# Altium project MOD-ADC-10.PrjPCB (part 1 of 2)
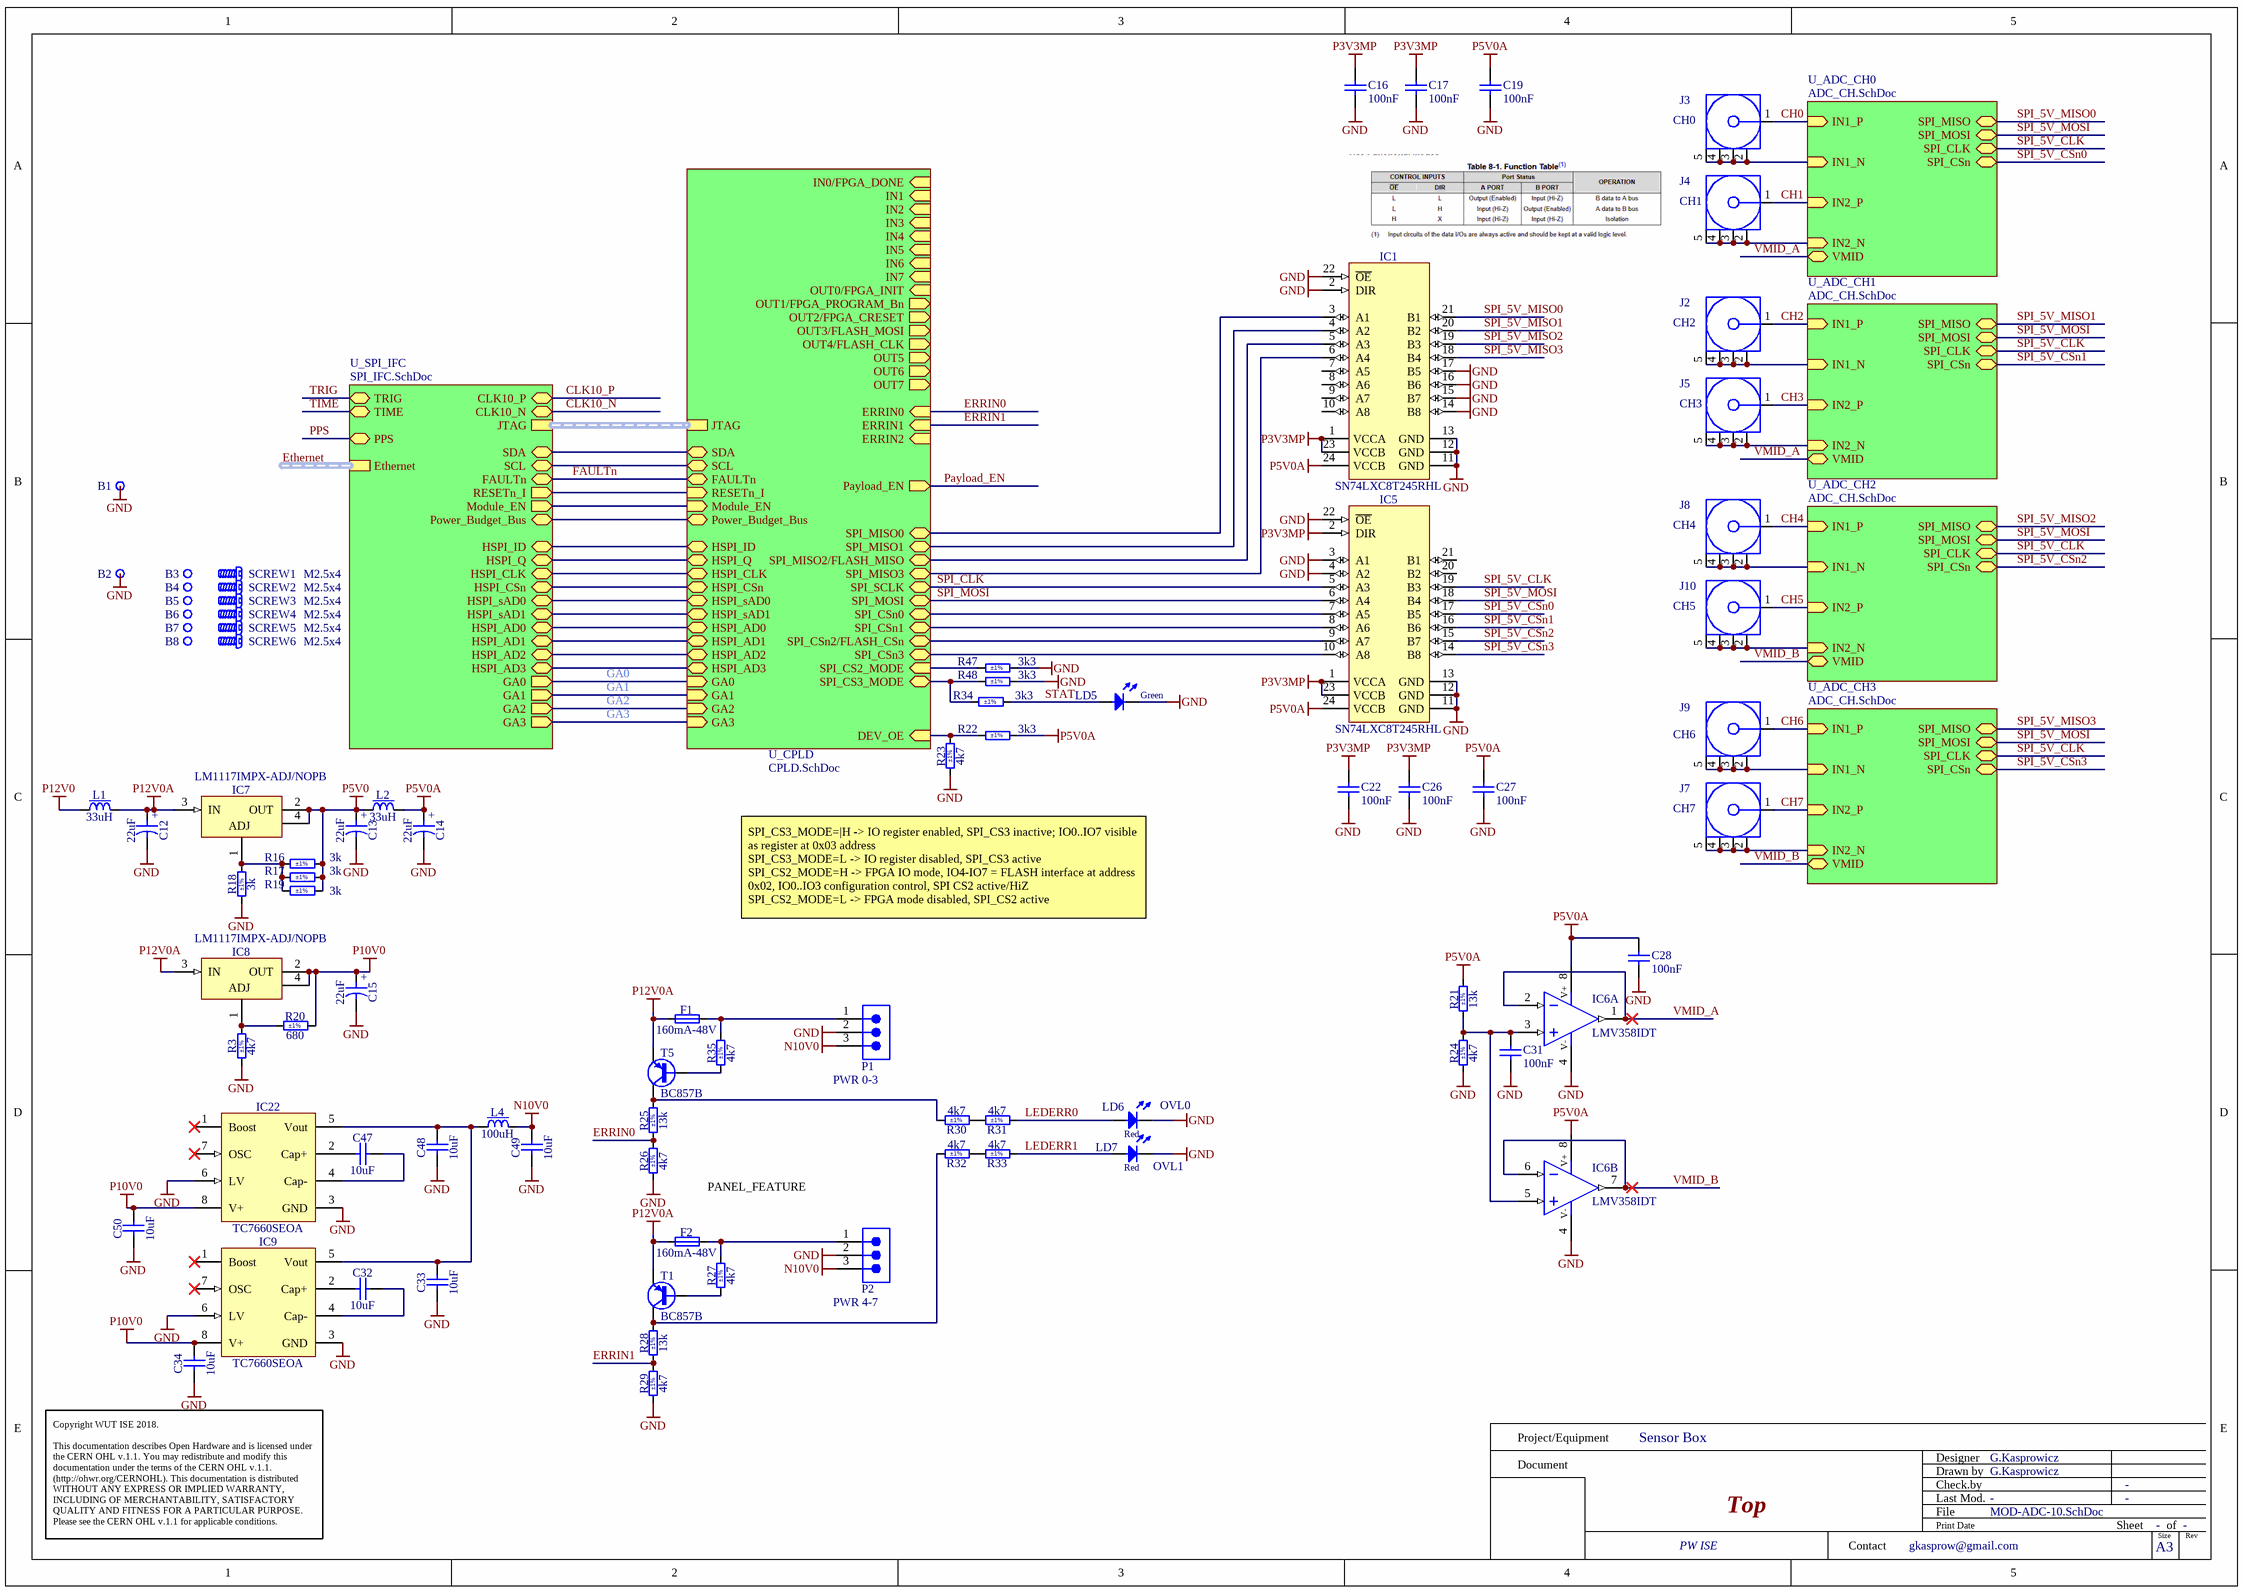
[diagram p0: MOD-ADC-10.SchDoc]
4 sheets, 199 parts. Net scope: hierarchical (ports join the sheet entries above them; power ports are global).
Board file: MOD-ADC-10.PCBDOC
Sheets:
  MOD-ADC-10.SchDoc
    U_SPI_IFC = SPI_IFC.SchDoc
    U_CPLD = CPLD.SchDoc
    U_ADC_CH0 = ADC_CH.SchDoc
    U_ADC_CH1 = ADC_CH.SchDoc
    U_ADC_CH2 = ADC_CH.SchDoc
    U_ADC_CH3 = ADC_CH.SchDoc

## Sheet MOD-ADC-10.SchDoc: =Project
size 420 x 297 mm; Author: G.Kasprowicz; CompanyName: WUT ISE; DrawnBy: G.Kasprowicz; Organization: WUT ISE; Address1: PW ISE; Address2: Nowowiejska 15/19 00-665 Warsaw; Address3: gkasprow@gmail.com; SheetNumber: -; SheetTotal: -; ModifiedBy: -; CheckedDate: -; Title2: Top; DivGrp: WUT ISE; Designer: G.Kasprowicz; SPICEModelCacheRYPVXPCY: <root> / <DocumentId>RYPVXPCY</DocumentId> / </root>; ModifiedDate: -; ProjectName: Sensor Box

### Parts
B1  Plated Hole  [MTG270_500]  (value not drawn)  (no BOM)
B2  Plated Hole  [MTG270_500]  (value not drawn)  (no BOM)
B3  Plated Hole  [MTG270_500]  (value not drawn)  (no BOM)
B4  Plated Hole  [MTG270_500]  (value not drawn)  (no BOM)
B5  Plated Hole  [MTG270_500]  (value not drawn)  (no BOM)
B6  Plated Hole  [MTG270_500]  (value not drawn)  (no BOM)
B7  Plated Hole  [MTG270_500]  (value not drawn)  (no BOM)
B8  Plated Hole  [MTG270_500]  (value not drawn)  (no BOM)
C12  22uF  [CAPMP3528X210N]
C13  22uF  [CAPMP3528X210N]
C14  22uF  [CAPMP3528X210N]
C15  22uF  [CAPMP3528X210N]
C16  100nF  [CAPC1005X55N]
C17  100nF  [CAPC1005X55N]
C19  100nF  [CAPC1005X55N]
C22  100nF  [CAPC1005X55N]
C26  100nF  [CAPC1005X55N]
C27  100nF  [CAPC1005X55N]
C28  100nF  [CAPC1005X55N]
C31  100nF  [CAPC1005X55N]
C32  10uF  [CAPC1608X80N]
C33  10uF  [CAPC1608X80N]
C34  10uF  [CAPC1608X80N]
C47  10uF  [CAPC1608X80N]
C48  10uF  [CAPC1608X80N]
C49  10uF  [CAPC1608X80N]
C50  10uF  [CAPC1608X80N]
F1  160mA-48V  [FUSRC3216X100N]
F2  160mA-48V  [FUSRC3216X100N]
IC1  SN74LXC8T245RHL  [TEXAS_RHL (S-PVQFN-N24)]
IC5  SN74LXC8T245RHL  [TEXAS_RHL (S-PVQFN-N24)]
IC6  LMV358IDT  [SOIC127P600X175-8N]  (parts A,B of 2)
IC7  LM1117IMPX-ADJ/NOPB  [SOT230P700X180-4N]
IC8  LM1117IMPX-ADJ/NOPB  [SOT230P700X180-4N]
IC9  TC7660SEOA  [SOIC127P600X175-8N]
IC22  TC7660SEOA  [SOIC127P600X175-8N]
J2  PANEL_LABEL: CH2  [60611002111502]  (hidden comment: 60611002111502)
J3  PANEL_LABEL: CH0  [60611002111502]  (hidden comment: 60611002111502)
J4  PANEL_LABEL: CH1  [60611002111502]  (hidden comment: 60611002111502)
J5  PANEL_LABEL: CH3  [60611002111502]  (hidden comment: 60611002111502)
J7  PANEL_LABEL: CH7  [60611002111502]  (hidden comment: 60611002111502)
J8  PANEL_LABEL: CH4  [60611002111502]  (hidden comment: 60611002111502)
J9  PANEL_LABEL: CH6  [60611002111502]  (hidden comment: 60611002111502)
J10  PANEL_LABEL: CH5  [60611002111502]  (hidden comment: 60611002111502)
L1  33uH  [IND_WURTH_WE-TPC_4828]
L2  33uH  [IND_WURTH_WE-TPC_4828]
L4  100uH  [INDM3225X240N]
LD5  Green  [LED_AVAGO_HSME-C120]
LD6  Red  PANEL_LABEL: OVL0  [LED_AVAGO_HSMC-C120]
LD7  Red  PANEL_LABEL: OVL1  [LED_AVAGO_HSMC-C120]
P1  PANEL_LABEL: PWR 0-3  [691382010003]  (hidden comment: 691382010003)
P2  PANEL_LABEL: PWR 4-7  [691382010003]  (hidden comment: 691382010003)
R3  4k7  Tolerance: ±1%  [RESC1608X55N]
R16  3k  Tolerance: ±1%  [RESC1608X55N]
R17  3k  Tolerance: ±1%  [RESC1608X55N]
R18  3k  Tolerance: ±1%  [RESC1608X55N]
R19  3k  Tolerance: ±1%  [RESC1608X55N]
R20  680  Tolerance: ±1%  [RESC1608X55N]
R21  13k  Tolerance: ±1%  [RESC1005X40N]
R22  3k3  Tolerance: ±1%  [RESC1005X40N]
R23  4k7  Tolerance: ±1%  [RESC1608X55N]
R24  4k7  Tolerance: ±1%  [RESC1608X55N]
R25  13k  Tolerance: ±1%  [RESC1005X40N]
R26  4k7  Tolerance: ±1%  [RESC1608X55N]
R27  4k7  Tolerance: ±1%  [RESC1608X55N]
R28  13k  Tolerance: ±1%  [RESC1005X40N]
R29  4k7  Tolerance: ±1%  [RESC1608X55N]
R30  4k7  Tolerance: ±1%  [RESC1608X55N]
R31  4k7  Tolerance: ±1%  [RESC1608X55N]
R32  4k7  Tolerance: ±1%  [RESC1608X55N]
R33  4k7  Tolerance: ±1%  [RESC1608X55N]
R34  3k3  Tolerance: ±1%  [RESC1005X40N]
R35  4k7  Tolerance: ±1%  [RESC1608X55N]
R47  3k3  Tolerance: ±1%  [RESC1005X40N]
R48  3k3  Tolerance: ±1%  [RESC1005X40N]
SCREW1  M2.5x4  [BOSSARD_BN5687-3061587_v]
SCREW2  M2.5x4  [BOSSARD_BN5687-3061587_v]
SCREW3  M2.5x4  [BOSSARD_BN5687-3061587_v]
SCREW4  M2.5x4  [BOSSARD_BN5687-3061587_v]
SCREW5  M2.5x4  [BOSSARD_BN5687-3061587_v]
SCREW6  M2.5x4  [BOSSARD_BN5687-3061587_v]
T1  BC857B  [SOT95P230X110-3N]
T5  BC857B  [SOT95P230X110-3N]

### Sub-sheets
U_ADC_CH0 = ADC_CH.SchDoc: SPI_MISO (bidir), SPI_MOSI (bidir), SPI_CLK (bidir), SPI_CSn (bidir), IN2_P (in), IN2_N (in), IN1_P (in), IN1_N (in), VMID (bidir)
U_ADC_CH1 = ADC_CH.SchDoc: SPI_MISO (bidir), SPI_MOSI (bidir), SPI_CLK (bidir), SPI_CSn (bidir), IN2_P (in), IN2_N (in), IN1_P (in), IN1_N (in), VMID (bidir)
U_ADC_CH2 = ADC_CH.SchDoc: SPI_MISO (bidir), SPI_MOSI (bidir), SPI_CLK (bidir), SPI_CSn (bidir), IN2_P (in), IN2_N (in), IN1_P (in), IN1_N (in), VMID (bidir)
U_ADC_CH3 = ADC_CH.SchDoc: SPI_MISO (bidir), SPI_MOSI (bidir), SPI_CLK (bidir), SPI_CSn (bidir), IN2_P (in), IN2_N (in), IN1_P (in), IN1_N (in), VMID (bidir)
U_CPLD = CPLD.SchDoc: SDA (bidir), SCL (bidir), RESETn_I (in), HSPI_ID (bidir), HSPI_Q (bidir), HSPI_CLK (bidir), HSPI_CSn (bidir), HSPI_sAD0 (bidir), HSPI_sAD1 (bidir), HSPI_AD0 (bidir), HSPI_AD1 (bidir), HSPI_AD2 (bidir), HSPI_AD3 (bidir), SPI_MISO2/FLASH_MISO (bidir), SPI_CSn3 (bidir), SPI_CSn1 (bidir), SPI_SCLK (bidir), SPI_MISO3 (bidir), SPI_MISO0 (bidir), SPI_CSn0 (bidir), SPI_MOSI (bidir), SPI_CSn2/FLASH_CSn (bidir), SPI_MISO1 (bidir), GA0 (in), GA1 (in), GA2 (in), GA3 (in), DEV_OE (in), FAULTn (bidir), Module_EN (in), IN0/FPGA_DONE (in), IN1 (in), IN2 (in), IN3 (in), IN4 (in), IN5 (in), IN6 (in), IN7 (in), OUT0/FPGA_INIT (in), OUT1/FPGA_PROGRAM_Bn (out), OUT2/FPGA_CRESET (out), OUT3/FLASH_MOSI (out), OUT4/FLASH_CLK (out), OUT5 (out), OUT6 (out), OUT7 (out), SPI_CS3_MODE (bidir), SPI_CS2_MODE (in), Payload_EN (out), Power_Budget_Bus (bidir), JTAG (harness JTAG), ERRIN0 (in), ERRIN1 (in), ERRIN2 (in)
U_SPI_IFC = SPI_IFC.SchDoc: SCL (bidir), CLK10_P (bidir), HSPI_AD3 (bidir), CLK10_N (bidir), RESETn_I (out), SDA (bidir), HSPI_CLK (bidir), HSPI_Q (bidir), HSPI_sAD0 (bidir), HSPI_ID (bidir), HSPI_AD2 (bidir), HSPI_CSn (bidir), HSPI_AD1 (bidir), HSPI_sAD1 (bidir), HSPI_AD0 (bidir), GA0 (out), GA1 (out), GA2 (out), GA3 (out), TRIG (bidir), TIME (bidir), FAULTn (bidir), Module_EN (out), PPS (bidir), Power_Budget_Bus (bidir), JTAG (harness JTAG), Ethernet (harness Ethernet)

### Nets
GND: B1.1 B2.1 C12.2 C13.2 C14.2 C15.2 C16.1 C17.1 C19.1 C22.1 C26.1 C27.1 C28.1 C31.1 C33.1 C34.1 C48.1 C49.1 C50.1 IC1.2(DIR) IC1.11(GND) IC1.12(GND) IC1.13(GND) IC1.14(B8) IC1.15(B7) IC1.16(B6) IC1.17(B5) IC1.22(~{OE}) IC5.3(A1) IC5.4(A2) IC5.11(GND) IC5.12(GND) IC5.13(GND) IC5.22(~{OE}) IC6.4(V-) IC9.3(GND) IC9.6(LV) IC22.3(GND) IC22.6(LV) LD5.1(C) LD6.1(C) LD7.1(C) P1.2 P2.2 R3.1 R18.1 R23.1 R24.1 R26.1 R29.1 R47.2 R48.2
N10V0: C49.2 L4.2 P1.3 P2.3
P3V3MP: C16.2 C17.2 C22.2 C26.2 IC1.1(VCCA) IC1.23(VCCB) IC5.1(VCCA) IC5.2(DIR) IC5.23(VCCB)
P5V0: C13.1 IC7.2(OUT) IC7.4(OUT) L2.1 R16.1 R17.1 R19.1
P5V0A: C14.1 C19.2 C27.2 C28.2 IC1.24(VCCB) IC5.24(VCCB) IC6.8(V+) L2.2 R21.2 R22.2
P10V0: C15.1 C34.2 C50.2 IC8.2(OUT) IC8.4(OUT) IC9.8(V+) IC22.8(V+) R20.2
P12V0: L1.1
P12V0A: C12.1 F1.2 F2.2 IC7.3(IN) IC8.3(IN) L1.2 T1.2(E) T5.2(E)
CH0: J3.1(Signal) ; sheet U_ADC_CH0/IN1_P
CH1: J4.1(Signal) ; sheet U_ADC_CH0/IN2_P
CH2: J2.1(Signal) ; sheet U_ADC_CH1/IN1_P
CH3: J5.1(Signal) ; sheet U_ADC_CH1/IN2_P
CH4: J8.1(Signal) ; sheet U_ADC_CH2/IN1_P
CH5: J10.1(Signal) ; sheet U_ADC_CH2/IN2_P
CH6: J9.1(Signal) ; sheet U_ADC_CH3/IN1_P
CH7: J7.1(Signal) ; sheet U_ADC_CH3/IN2_P
ERRIN0: R25.1 R26.2 ; sheet U_CPLD/ERRIN0
ERRIN1: R28.1 R29.2 ; sheet U_CPLD/ERRIN1
FAULTn: sheet U_SPI_IFC/FAULTn, sheet U_CPLD/FAULTn
GA0: sheet U_SPI_IFC/GA0, sheet U_CPLD/GA0
GA1: sheet U_SPI_IFC/GA1, sheet U_CPLD/GA1
GA2: sheet U_SPI_IFC/GA2, sheet U_CPLD/GA2
GA3: sheet U_SPI_IFC/GA3, sheet U_CPLD/GA3
HSPI_AD0: sheet U_SPI_IFC/HSPI_AD0, sheet U_CPLD/HSPI_AD0
HSPI_AD1: sheet U_SPI_IFC/HSPI_AD1, sheet U_CPLD/HSPI_AD1
HSPI_AD2: sheet U_SPI_IFC/HSPI_AD2, sheet U_CPLD/HSPI_AD2
HSPI_AD3: sheet U_SPI_IFC/HSPI_AD3, sheet U_CPLD/HSPI_AD3
HSPI_CLK: sheet U_SPI_IFC/HSPI_CLK, sheet U_CPLD/HSPI_CLK
HSPI_CSn: sheet U_SPI_IFC/HSPI_CSn, sheet U_CPLD/HSPI_CSn
HSPI_ID: sheet U_SPI_IFC/HSPI_ID, sheet U_CPLD/HSPI_ID
HSPI_Q: sheet U_SPI_IFC/HSPI_Q, sheet U_CPLD/HSPI_Q
HSPI_sAD0: sheet U_SPI_IFC/HSPI_sAD0, sheet U_CPLD/HSPI_sAD0
HSPI_sAD1: sheet U_SPI_IFC/HSPI_sAD1, sheet U_CPLD/HSPI_sAD1
IN1_N: J3.2(GND) J3.3(GND) J3.4(GND) J3.5(GND) ; sheet U_ADC_CH0/IN1_N
IN1_N: J2.2(GND) J2.3(GND) J2.4(GND) J2.5(GND) ; sheet U_ADC_CH1/IN1_N  [a separate net that carries the same name]
IN1_N: J8.2(GND) J8.3(GND) J8.4(GND) J8.5(GND) ; sheet U_ADC_CH2/IN1_N  [a separate net that carries the same name]
IN1_N: J9.2(GND) J9.3(GND) J9.4(GND) J9.5(GND) ; sheet U_ADC_CH3/IN1_N  [a separate net that carries the same name]
IN2_N: J4.2(GND) J4.3(GND) J4.4(GND) J4.5(GND) ; sheet U_ADC_CH0/IN2_N
IN2_N: J5.2(GND) J5.3(GND) J5.4(GND) J5.5(GND) ; sheet U_ADC_CH1/IN2_N  [a separate net that carries the same name]
IN2_N: J10.2(GND) J10.3(GND) J10.4(GND) J10.5(GND) ; sheet U_ADC_CH2/IN2_N  [a separate net that carries the same name]
IN2_N: J7.2(GND) J7.3(GND) J7.4(GND) J7.5(GND) ; sheet U_ADC_CH3/IN2_N  [a separate net that carries the same name]
LEDERR0: LD6.2(A) R31.1
LEDERR1: LD7.2(A) R33.1
Module_EN: sheet U_SPI_IFC/Module_EN, sheet U_CPLD/Module_EN
RESETn: sheet U_SPI_IFC/RESETn_I, sheet U_CPLD/RESETn_I
SCL: sheet U_SPI_IFC/SCL, sheet U_CPLD/SCL
SDA: sheet U_SPI_IFC/SDA, sheet U_CPLD/SDA
SPI_5V_CLK: IC5.19(B3) ; sheet U_ADC_CH0/SPI_CLK, sheet U_ADC_CH1/SPI_CLK, sheet U_ADC_CH2/SPI_CLK, sheet U_ADC_CH3/SPI_CLK
SPI_5V_CSn0: IC5.17(B5) ; sheet U_ADC_CH0/SPI_CSn
SPI_5V_CSn1: IC5.16(B6) ; sheet U_ADC_CH1/SPI_CSn
SPI_5V_CSn2: IC5.15(B7) ; sheet U_ADC_CH2/SPI_CSn
SPI_5V_CSn3: IC5.14(B8) ; sheet U_ADC_CH3/SPI_CSn
SPI_5V_MISO0: IC1.21(B1) ; sheet U_ADC_CH0/SPI_MISO
SPI_5V_MISO1: IC1.20(B2) ; sheet U_ADC_CH1/SPI_MISO
SPI_5V_MISO2: IC1.19(B3) ; sheet U_ADC_CH2/SPI_MISO
SPI_5V_MISO3: IC1.18(B4) ; sheet U_ADC_CH3/SPI_MISO
SPI_5V_MOSI: IC5.18(B4) ; sheet U_ADC_CH0/SPI_MOSI, sheet U_ADC_CH1/SPI_MOSI, sheet U_ADC_CH2/SPI_MOSI, sheet U_ADC_CH3/SPI_MOSI
SPI_CLK: IC5.5(A3) ; sheet U_CPLD/SPI_SCLK
SPI_CSn0: IC5.7(A5) ; sheet U_CPLD/SPI_CSn0
SPI_CSn1: IC5.8(A6) ; sheet U_CPLD/SPI_CSn1
SPI_CSn2: IC5.9(A7) ; sheet U_CPLD/SPI_CSn2/FLASH_CSn
SPI_CSn3: IC5.10(A8) ; sheet U_CPLD/SPI_CSn3
SPI_MISO0: IC1.3(A1) ; sheet U_CPLD/SPI_MISO0
SPI_MISO1: IC1.4(A2) ; sheet U_CPLD/SPI_MISO1
SPI_MISO2: IC1.5(A3) ; sheet U_CPLD/SPI_MISO2/FLASH_MISO
SPI_MISO3: IC1.6(A4) ; sheet U_CPLD/SPI_MISO3
SPI_MOSI: IC5.6(A4) ; sheet U_CPLD/SPI_MOSI
STAT: LD5.2(A) R34.1
VMID_A: IC6.1(OUT) IC6.2(IN-) ; sheet U_ADC_CH0/VMID, sheet U_ADC_CH1/VMID
VMID_B: IC6.6(IN-) IC6.7(OUT) ; sheet U_ADC_CH2/VMID, sheet U_ADC_CH3/VMID
NetC31_2: C31.2 IC6.3(IN+) IC6.5(IN+) R21.1 R24.2
NetC32_1: C32.1 IC9.2(Cap+)
NetC32_2: C32.2 IC9.4(Cap-)
NetC33_2: C33.2 C48.2 IC9.5(Vout) IC22.5(Vout) L4.1
NetC47_1: C47.1 IC22.2(Cap+)
NetC47_2: C47.2 IC22.4(Cap-)
NetF1_1: F1.1 P1.1 R35.2
NetF2_1: F2.1 P2.1 R27.2
NetIC2_30: R22.1 R23.2 ; sheet U_CPLD/DEV_OE
NetIC2_67: R34.2 R48.1 ; sheet U_CPLD/SPI_CS3_MODE
NetIC2_68: R47.1 ; sheet U_CPLD/SPI_CS2_MODE
NetIC7_1: IC7.1(ADJ) R16.2 R17.2 R18.2 R19.2
NetIC8_1: IC8.1(ADJ) R3.2 R20.1
NetJ1_B17: sheet U_SPI_IFC/Power_Budget_Bus, sheet U_CPLD/Power_Budget_Bus
NetR25_2: R25.2 R30.2 T5.3(C)
NetR27_1: R27.1 T1.1(B)
NetR28_2: R28.2 R32.2 T1.3(C)
NetR30_1: R30.1 R31.2
NetR32_1: R32.1 R33.2
NetR35_1: R35.1 T5.1(B)

Not connected (* = marked no-connect by the designer): B3 1; B4 1; B5 1; B6 1; B7 1; B8 1; IC1 7(A5) 8(A6) 9(A7) 10(A8); IC5 20(B2) 21(B1); IC9 1(Boost)* 7(OSC)*; IC22 1(Boost)* 7(OSC)*

### Buses and harness runs
harness Ethernet = sheet U_SPI_IFC/Ethernet
harness sheet U_CPLD/JTAG = sheet U_SPI_IFC/JTAG

### Notes on the sheet
- (near R23) SPI_CS3_MODE=|H -> IO register enabled, SPI_CS3 inactive; IO0..IO7 visible as register at 0x03 address
  SPI_CS3_MODE=L -> IO register disabled, SPI_CS3 active
  SPI_CS2_MODE=H -> FPGA IO mode, IO4-IO7 = FLASH interface at address 0x02, IO0..IO3 configuration control, SPI CS2 active/HiZ
  SPI_CS2_MODE=L -> FPGA mode disabled, SPI_CS2 active
- PANEL_FEATURE
- Project/Equipment
- Document
- Designer
- Drawn by
- Check.by
- Copyright WUT ISE 2018.
  This documentation describes Open Hardware and is licensed under the CERN OHL v.1.1. You may redistribute and modify this documentation under the terms of the CERN OHL v.1.1. (http://ohwr.org/CERNOHL). This documentation is distributed WITHOUT ANY EXPRESS OR IMPLIED WARRANTY, INCLUDING OF MERCHANTABILITY, SATISFACTORY QUALITY AND FITNESS FOR A PARTICULAR PURPOSE. Please see the CERN OHL v.1.1 for applicable conditions.
- Contact
- File
- Last Mod.
- Print Date
- Sheet
- Size
- A3
- of
- Rev
- (in symbol CTE3528-21_22UF_20V_10%) +

### Library data of the parts
B1-B8 = PLATED_HOLE2.7_PAD5.0: Single Terminal Socket; Part Description: Plated Through Hole: Hole Dia.=2.7mm Pad Dia.=5.0mm; Mounted: No; Part Number: PLATED_HOLE2.7_PAD5.0; Component Type: Standard (No BOM); Pin Count: 1; Family: Plated Hole; Socket: No; SMD: No; Sense: No; Status: None; ComponentHeight: 0mm; HelpURL: Undefined; Author: CERN DEM JMW; CreateDate: 27.09.2011; LatestRevisionDate: 27.09.2011; PackageDescription: Plated Through Hole: Hole Dia.=2.7mm Pad Dia.=5.0mm
C12-C15 = CTE3528-21_22UF_20V_10%: Polarised capacitor; Part Description: Solid Tantalum Chip Capacitor; Manufacturer: GENERIC; Manufacturer1 Part Number: TAJB226K020R; Voltage: 20V; Tolerance: ±10%; Part Number: CTE3528-21_22UF_20V_10%; Component Kind: Standard; Component Type: Standard; Pin Count: 2; Value: 22uF; Status: Preferred; Manufacturer Part Number: CTE3528-21_22UF_20V_10%; Case: B; Mounted: Yes; Socket: No; SMD: Yes; Sense: No; Manufacturer1 Example: AVX; Manufacturer1 ComponentHeight: 2.1mm; HelpURL: \\cern.ch\dfs\Applications\Altium\Datasheets\CTE_AVX_TAJ.pdf; Author: CERN DEM JLC; CreateDate: 03.12.2007; LatestRevisionDate: 03.12.2007
C16 C17 C19 C22 C26-C28 C31 = CC0402_100NF_16V_10%_X7R: Non-polarised capacitor; Part Description: SMD Multilayer Chip Ceramic Capacitor; Manufacturer: GENERIC; Manufacturer1 Part Number: GRM155R71C104KA88D; Voltage: 16V; TC: X7R; Tolerance: ±10%; Part Number: CC0402_100NF_16V_10%_X7R; Component Kind: Standard; Component Type: Standard; Pin Count: 2; Value: 100nF; Status: Not Recommended; Manufacturer Part Number: CC0402_100NF_16V_10%_X7R; Case: 0402; Mounted: Yes; Socket: No; SMD: Yes; Sense: No; Manufacturer1 Example: MURATA; Manufacturer1 ComponentHeight: 0.55mm; HelpURL: \\cern.ch\dfs\Applications\Altium\Datasheets\CC0402_X7R_MURATA_GRM.pdf; Author: CERN DEM JLC; CreateDate: 12/5/2013; LatestRevisionDate: 12/3/2007
C32-C34 C47-C50 = CC0603_10UF_10V_10%_X5R: Non-polarised capacitor; Part Description: SMD Multilayer Chip Ceramic Capacitor; Manufacturer: GENERIC; Manufacturer1 Part Number: GRM188R61A106KE69D; Voltage: 10V; TC: X5R; Tolerance: ±10%; Part Number: CC0603_10UF_10V_10%_X5R; Component Kind: Standard; Component Type: Standard; Pin Count: 2; Value: 10uF; Status: None; Manufacturer Part Number: CC0603_10UF_10V_10%_X5R; Case: 0603; Mounted: Yes; Socket: No; SMD: Yes; Sense: No; Manufacturer1 Example: MURATA; Manufacturer1 ComponentHeight: 0.8mm; HelpURL: \\cern.ch\dfs\Applications\Altium\Datasheets\CC0603_MURATA_GRM188R61A106KE69D.pdf; Author: CERN DEM JLC; CreateDate: 31.01.2017; LatestRevisionDate: 31.01.2017
F1 F2 = FUSR1206_TYCO_NANOSMD016F: Fuse; Part Description: PolySwitch® PTC Overcurrent Protection Device; Manufacturer: TYCO ELECTRONICS; Manufacturer Part Number: nanoSMDC016F; PressFit: No; Status Comment: Replaced by LITTELFUSE nanoSMDC016F; Part Number: FUSR1206_TYCO_NANOSMD016F; Component Kind: Standard; Component Type: Standard; Pin Count: 2; PackageDescription: Chip Resettable Fuse, 2-Leads, Body 3.2mmx1.6mm, IPC Medium Density; Family: Fuses Resettable; Mounted: Yes; Socket: No; SMD: Yes; Sense: No; Status: Obsolete; Value: 160mA-48V; ComponentHeight: 1mm; HelpURL: \\cern.ch\dfs\Applications\Altium\Datasheets\FUSR_TYCO_NanoSMD016F.pdf; Author: CERN DEM JLC; CreateDate: 03.07.2008; LatestRevisionDate: 04.08.2008
IC1 IC5 = SN74LXC8T245RHL: 8-Bit Dual-Supply Bus Transceiver With Configurable Voltage Translation and 3-State Outputs; Part Description: SN74LXC8T245 8-bit Dual-Supply Bus Transceiver with Configurable Level Shifting and 3-State Outputs; Manufacturer: TEXAS INSTRUMENTS; PressFit: No; Bonding: No; Part Number: SN74LXC8T245RHL; Component Kind: Standard; Component Type: Standard; Device: SN74LXC8T245RHL; PackageDescription: TEXAS Case Style RHL (S-PVQFN-N24), QFN, 0.50mm Pitch, Rect.; 24 Pin, 5.50mm L X 3.50mm W X 1mm H body (w/Thermal Tab 4.05 X 2.05mm); Manufacturer Part Number: SN74LXC8T245RHL; Pin Count: 25; Case: QFN24; Mounted: Yes; Socket: No; SMD: Yes; Sense: No; ComponentHeight: 1mm; Author: CERN DEM BC; HelpURL: \\cern.ch\dfs\Applications\Altium\Datasheets\SN74LXC8T245.pdf; CreateDate: 05.05.2020; LatestRevisionDate: 05.05.2020
IC6 = LMV358IDT: Dual Operational Amplifier; Part Description: Dual General Purpose, Low Voltage, Tiny Pack Comparator; Manufacturer: ST MICROELECTRONICS; PressFit: No; Bonding: No; Part Number: LMV358IDT; Component Kind: Standard; Component Type: Standard; Device: LMV358IDT; PackageDescription: SOIC 8, Pitch 1.27mm - Body 4x5mm, IPC Medium Density; Manufacturer Part Number: LMV358IDT; Pin Count: 8; Case: SOIC8; Mounted: Yes; Socket: No; SMD: Yes; Sense: No; ComponentHeight: 1.75mm; Author: CERN DEM HF; HelpURL: \\cern.ch\dfs\Applications\Altium\Datasheets\LMV358.pdf; CreateDate: 21.12.2023; LatestRevisionDate: 21.12.2023
IC7 IC8 = LM1117IMPX-ADJ/NOPB: 3-Terminal Regulator 1=Adj 2=OUT 3=IN 4=OUT; Part Description: 1.25V to 13.8V, 800mA, Adjustable Low-Dropout Linear Regulator; Manufacturer: TEXAS INSTRUMENTS; PressFit: No; Bonding: No; Part Number: LM1117IMPX-ADJ/NOPB; Component Kind: Standard; Component Type: Standard; Device: LM1117IMPX-ADJ/NOPB; PackageDescription: SOT223, 2.30mm Pitch; 4 Pin, 3.70mm W X 6.70mm L X 1.80mm H body, IPC Medium Density; Manufacturer Part Number: LM1117IMPX-ADJ; Pin Count: 4; Case: SOT223; Mounted: Yes; Socket: No; SMD: Yes; Sense: No; ComponentHeight: 1.8mm; HelpURL: \\cern.ch\dfs\Applications\Altium\Datasheets\LM1117IMPX-ADJ-NOPB.pdf; Author: CERN DEM JLC; CreateDate: 05.10.2011; LatestRevisionDate: 01.06.2022
IC9 IC22 = TC7660SEOA: Super Charge Pump DC-to-DC Voltage Converter; Manufacturer: MICROCHIP TECHNOLOGY; PressFit: No; Bonding: No; Part Number: TC7660SEOA; Component Kind: Standard; Component Type: Standard; Device: TC7660SEOA; PackageDescription: SOIC 8, Pitch 1.27mm, Body 4x5mm, IPC Medium Density; Part Description: Super Charge Pump DC-to-DC Voltage Converter; Manufacturer Part Number: TC7660SEOA; Pin Count: 8; Case: SOIC8; Mounted: Yes; Socket: No; SMD: Yes; Sense: No; ComponentHeight: 1.75mm; HelpURL: \\cern.ch\dfs\Applications\Altium\Datasheets\TC7660S.pdf; Author: CERN DEM HF; CreateDate: 28.02.2024; LatestRevisionDate: 28.02.2024
J2-J5 J7-J10 = 60611002111502: WR-MCX PCB Jack, THT, Right Angle, Solder Leg 1.73mm; Manufacturer: Wurth Elektronik; Center Contact Diameter: 0.96mm; Connector Type: MCX; Frequency Range: DC~6GHz; Impedance: 50Ω; Interface Type: IEC 61169-36; PANEL_FEATURE: Yes; ComponentLink1Description: Website Link; ComponentLink1URL: https://www.we-online.com/redexpert/article/60611002111502?ad; ComponentLink2Description: Datasheet Link; ComponentLink2URL: https://www.we-online.com/redexpert/spec/60611002111502?ad; Manufacturer Part Number: 60611002111502; Category: Coaxial Connectors; Match Code: WR-MCX; Mount: Through Hole; Operating Temperature Max: 155°C; Operating Temperature Min: -55°C; Packaging: Tray; Gender: Jack; Orientation: Right Angle
L1 L2 = IND_33UH_30%_WURTH_WE-TPC_744043330: Inductor With Core; Part Description: Shielded Tiny Power Inductor (WE-TPC Series); Manufacturer: WURTH ELEKTRONIK; Power: 820mA; Resistance: 0.23R; Tolerance: ±30%; Part Number: IND_33UH_30%_WURTH_WE-TPC_744043330; Component Kind: Standard; Component Type: Standard; Pin Count: 2; Value: 33uH; Manufacturer Part Number: 744043330; Mounted: Yes; Socket: No; SMD: Yes; Sense: No; ComponentHeight: 3mm; HelpURL: \\cern.ch\dfs\Applications\Altium\Datasheets\IND_WURTH_WE-TPC_744043330.pdf; Author: CERN DEM JLC; CreateDate: 24.11.2014; LatestRevisionDate: 24.11.2014
L4 = IND1210_100UH_10%_EPCOS_B82422H: Inductor With Core; Part Description: SMT Inductor SIMID Series; Manufacturer: EPCOS; Manufacturer Part Number: B82422H1104K000; Power: 150mA; Resistance: 4.8R; Tolerance: ±10%; Part Number: IND1210_100UH_10%_EPCOS_B82422H; Component Kind: Standard; Component Type: Standard; Pin Count: 2; Value: 100uH; Case: 1210; Mounted: Yes; Socket: No; SMD: Yes; Sense: No; ComponentHeight: 2.4mm; HelpURL: \\cern.ch\dfs\Applications\Altium\Datasheets\IND1210_EPCOS_B82422H.pdf; Author: CERN DEM JLC; CreateDate: 04.06.2012; LatestRevisionDate: 04.06.2012
LD5 = LED_AVAGO_HSME-C120: LED Green 1C 2A; Part Description: High Performance Right Angle Chip Green LED; Manufacturer: AVAGO TECHNOLOGIES; PressFit: No; Bonding: No; PANEL_FEATURE: Yes; PANEL_LABEL: STAT; Part Number: LED_AVAGO_HSME-C120; Component Kind: Standard; Component Type: Standard; Color: Green; PackageDescription: Green Chip LED, 2-Leads, Body 1.7x1.1mm, Side Emitting Package; Status: Not Recommended; Manufacturer Part Number: HSME-C120; Pin Count: 2; Mounted: Yes; Socket: No; SMD: Yes; Sense: No; ComponentHeight: 0.7mm; HelpURL: \\cern.ch\dfs\Applications\Altium\Datasheets\LED_AVAGO_HSME-C120.pdf; ComponentLink1URL: \\cern.ch\dfs\Applications\Altium\Datasheets\LED_AVAGO_HSME-C110_DESIGN-GUIDE.pdf; ComponentLink1Description: Design Guide; Author: CERN DEM JMW; CreateDate: 22.07.2009; LatestRevisionDate: 20.06.2012
LD6 LD7 = LED_AVAGO_HSMC-C120: LED Red 1C 2A; Part Description: High Performance Right Angle Chip Red LED; Manufacturer: AVAGO TECHNOLOGIES; PressFit: No; Bonding: No; PANEL_FEATURE: Yes; Part Number: LED_AVAGO_HSMC-C120; Component Kind: Standard; Component Type: Standard; Color: Red; PackageDescription: Red Chip LED, 2-Leads, Body 1.7x1.1mm, Side Emitting Package; Status: Not Recommended; Manufacturer Part Number: HSMC-C120; Pin Count: 2; Mounted: Yes; Socket: No; SMD: Yes; Sense: No; ComponentHeight: 0.7mm; HelpURL: \\cern.ch\dfs\Applications\Altium\Datasheets\LED_AVAGO_HSMC-C120.pdf; ComponentLink1URL: \\cern.ch\dfs\Applications\Altium\Datasheets\LED_AVAGO_HSMC-C120_DESIGN-GUIDE.pdf; ComponentLink1Description: Design Guide; Author: CERN DEM JMW; CreateDate: 22.07.2009; LatestRevisionDate: 20.06.2012
P1 P2 = 691382010003: WR-TBL Series 382 Horizontal PCB Header, THT, pitch 2.5mm, 3p; Manufacturer: Wurth Elektronik; Modularity: No; Rated Current: 4A; Working Voltage: 160V; PANEL_FEATURE: Yes; ComponentLink1Description: Website Link; ComponentLink1URL: https://www.we-online.com/redexpert/article/691382010003?ad; ComponentLink2Description: Datasheet Link; ComponentLink2URL: https://www.we-online.com/redexpert/spec/691382010003?ad; Manufacturer Part Number: 691382010003; Category: Terminal Blocks; Match Code: WR-TBL; Mount: Through Hole; Operating Temperature Max: 105°C; Operating Temperature Min: -40°C; Packaging: Box; Application: Pluggable; Number of Pins: 3; Number of Rows: 1; Orientation: Horizontal; Pitch: 2.5mm
R3 R23 R24 R26 R27 R29-R33 R35 = R0603_4K7_1%_0.1W_100PPM: Resistor - 1%; Part Description: General Purpose Thick Film Chip Resistor; Manufacturer: GENERIC; Manufacturer1 Part Number: NRC06F4701TRF; Power: 0.1W; TC: ±100ppm/°C; PressFit: No; Part Number: R0603_4K7_1%_0.1W_100PPM; Component Kind: Standard; Component Type: Standard; Pin Count: 2; Value: 4k7; Status: Preferred; Manufacturer Part Number: R0603_4K7_1%_0.1W_100PPM; Case: 0603; Mounted: Yes; Sense: No; Socket: No; SMD: Yes; Manufacturer1 Example: NIC COMPONENT; Manufacturer1 ComponentHeight: 0.55mm; HelpURL: \\cern.ch\dfs\Applications\Altium\Datasheets\R0603_NIC_NRC.pdf; Author: CERN DEM JLC; CreateDate: 03.12.2007; LatestRevisionDate: 13.03.2008
R16-R19 = R0603_3K_1%_0.33W_100PPM_VISHAY_CRCW-HP e3: Resistor - 1%; Part Description: Pulse Proof, High Power Thick Film Chip Resistor; Manufacturer: VISHAY DRALORIC; Manufacturer Part Number: CRCW06033K00FKEAHP; Power: 0.33W; TC: ±100ppm/°C; Voltage: 75V; PressFit: No; Part Number: R0603_3K_1%_0.33W_100PPM_VISHAY_CRCW-HP e3; Component Kind: Standard; Component Type: Standard; Pin Count: 2; Value: 3k; Status: None; Case: 0603; Mounted: Yes; Sense: No; Socket: No; SMD: Yes; ComponentHeight: 0.55mm; HelpURL: \\cern.ch\dfs\Applications\Altium\Datasheets\R0603_VISHAY_CRCW-HP e3.pdf; Author: CERN DEM BC; CreateDate: 01.03.2021; LatestRevisionDate: 01.03.2021
R20 = R0603_680R_1%_0.1W_100PPM: Resistor - 1%; Part Description: General Purpose Thick Film Chip Resistor; Manufacturer: GENERIC; Manufacturer1 Part Number: NRC06F6800TRF; Power: 0.1W; TC: ±100ppm/°C; PressFit: No; Part Number: R0603_680R_1%_0.1W_100PPM; Component Kind: Standard; Component Type: Standard; Pin Count: 2; Value: 680; Status: Preferred; Manufacturer Part Number: R0603_680R_1%_0.1W_100PPM; Case: 0603; Mounted: Yes; Sense: No; Socket: No; SMD: Yes; Manufacturer1 Example: NIC COMPONENT; Manufacturer1 ComponentHeight: 0.55mm; HelpURL: \\cern.ch\dfs\Applications\Altium\Datasheets\R0603_NIC_NRC.pdf; Author: CERN DEM JLC; CreateDate: 03.12.2007; LatestRevisionDate: 13.03.2008
R21 R25 R28 = R0402_13K_1%_0.0625W_100PPM: Resistor - 1%; Part Description: General Purpose Thick Film Chip Resistor; Manufacturer: GENERIC; Manufacturer1 Part Number: 232270671303L; TC: ±100ppm/°C; PressFit: No; Part Number: R0402_13K_1%_0.0625W_100PPM; Component Kind: Standard; Component Type: Standard; Pin Count: 2; Value: 13k; Status: Not Recommended; Power: 0.0625W; Manufacturer Part Number: R0402_13K_1%_0.0625W_100PPM; Case: 0402; Mounted: Yes; Sense: No; Socket: No; SMD: Yes; Manufacturer1 Example: YAGEO PHYCOMP; Manufacturer1 ComponentHeight: 0.4mm; HelpURL: \\cern.ch\dfs\Applications\Altium\Datasheets\R0402_Phycomp_RC0402.pdf; Author: CERN DEM JLC; CreateDate: 03.12.2007; LatestRevisionDate: 17.10.2012
R22 R34 R47 R48 = R0402_3K3_1%_0.0625W_100PPM: Resistor - 1%; Part Description: General Purpose Thick Film Chip Resistor; Manufacturer: GENERIC; Manufacturer1 Part Number: 232270673302L; TC: ±100ppm/°C; PressFit: No; Part Number: R0402_3K3_1%_0.0625W_100PPM; Component Kind: Standard; Component Type: Standard; Pin Count: 2; Value: 3k3; Status: Not Recommended; Power: 0.0625W; Manufacturer Part Number: R0402_3K3_1%_0.0625W_100PPM; Case: 0402; Mounted: Yes; Sense: No; Socket: No; SMD: Yes; Manufacturer1 Example: YAGEO PHYCOMP; Manufacturer1 ComponentHeight: 0.4mm; HelpURL: \\cern.ch\dfs\Applications\Altium\Datasheets\R0402_Phycomp_RC0402.pdf; Author: CERN DEM JLC; CreateDate: 03.12.2007; LatestRevisionDate: 17.10.2012
SCREW1-SCREW6 = BOSSARD_BN5687-3061587_v: Screw; Part Description: M2.5 L=4mm Hexalobular Socket Pan Head Screw, Fully Threaded, Stainless Steel A2; Manufacturer Part Number: BN5687 Art.3061587; PressFit: No; ClassName: Overlapping; Part Number: BOSSARD_BN5687-3061587_v; Component Kind: Standard; Component Type: Mechanical; Pin Count: 0; PackageDescription: M2.5 L=4mm Hexalobular Socket Pan Head Screw, Fully Threaded - Stainless Steel A2; Mounted: Yes; Socket: No; SMD: No; Sense: No; Status: None; Value: M2.5x4; Manufacturer: BOSSARD; ComponentHeight: 2.1mm; HelpURL: \\cern.ch\dfs\Applications\Altium\Datasheets\BOSSARD_BN5687-3061587.pdf; Author: CERN DEM JLC; CreateDate: 22.08.2013; LatestRevisionDate: 22.08.2013
T1 T5 = BC857B: PNP Transistor; Part Description: 45V 100mA PNP general-purpose transistors; Manufacturer: NXP SEMICONDUCTORS; PressFit: No; Bonding: No; Part Number: BC857B; Component Kind: Standard; Component Type: Standard; Device: BC857B; PackageDescription: SOT23, 3 pin, Pitch 0.95mm - 1.3mm W X 2.9mm L X 1.1mm H, IPC Medium Density; Manufacturer Part Number: BC857B; Pin Count: 3; Case: SOT23-3; Mounted: Yes; Socket: No; SMD: Yes; Sense: No; ComponentHeight: 1.1mm; HelpURL: \\cern.ch\dfs\Applications\Altium\Datasheets\BC857B.pdf; Author: CERN DEM JLC; CreateDate: 14.06.2011; LatestRevisionDate: 14.06.2011

## Sheet SPI_IFC.SchDoc: =Project
size 420 x 297 mm; Author: G.Kasprowicz; CompanyName: WUT ISE; DrawnBy: G.Kasprowicz; Organization: WUT ISE; Address1: PW ISE; Address2: Nowowiejska 15/19 00-665 Warsaw; Address3: gkasprow@gmail.com; SheetNumber: -; SheetTotal: -; ModifiedBy: -; CheckedDate: -; Title2: SPI IFC; DivGrp: WUT ISE; Designer: G.Kasprowicz; SPICEModelCacheRYPVXPCY: <root> / <DocumentId>RYPVXPCY</DocumentId> / </root>; ModifiedDate: -; ProjectName: Sensor Box
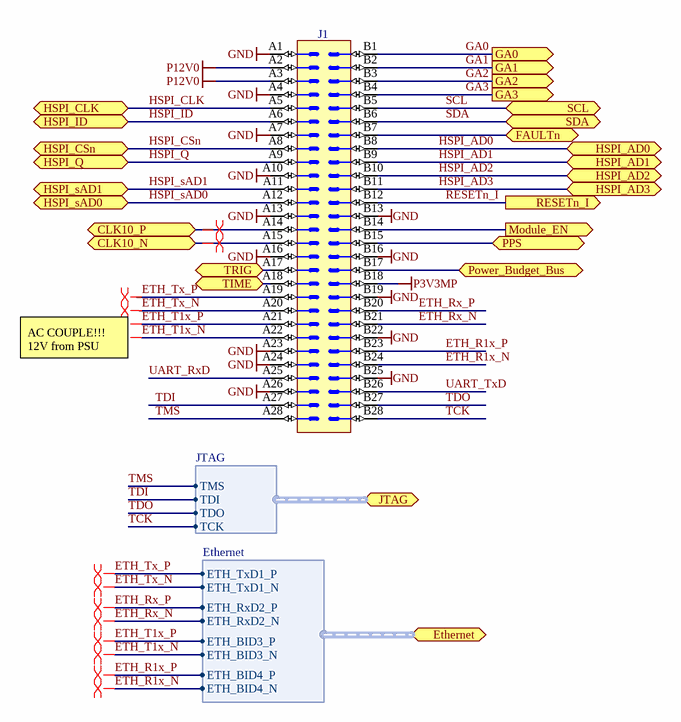
[diagram p1: SPI_IFC.SchDoc]

### Parts
J1  (no value)  [AMPHENOL_MINI-COOL-56P]

### Ports
CLK10_N (bidir), CLK10_P (bidir), Ethernet (bidir, harness Ethernet), FAULTn (bidir), GA0 (out), GA1 (out), GA2 (out), GA3 (out), HSPI_AD0 (bidir), HSPI_AD1 (bidir), HSPI_AD2 (bidir), HSPI_AD3 (bidir), HSPI_CLK (bidir), HSPI_CSn (bidir), HSPI_ID (bidir), HSPI_Q (bidir), HSPI_sAD0 (bidir), HSPI_sAD1 (bidir), JTAG (bidir, harness JTAG), Module_EN (out), Power_Budget_Bus (bidir), PPS (bidir), RESETn_I (out), SCL (bidir), SDA (bidir), TIME (bidir), TRIG (bidir)

### Harnesses
JTAG: TMS, TDI, TDO, TCK
Ethernet: ETH_TxD1_P, ETH_TxD1_N, ETH_RxD2_P, ETH_RxD2_N, ETH_BID3_P, ETH_BID3_N, ETH_BID4_P, ETH_BID4_N

### Nets
GND: J1.A1 J1.A4 J1.A7 J1.A10 J1.A13 J1.A16 J1.A23 J1.A24 J1.A26 J1.B13 J1.B16 J1.B19 J1.B22 J1.B25
P3V3MP: J1.B18
P12V0: J1.A2 J1.A3
CLK10_N: J1.A15 ; port CLK10_N
CLK10_P: J1.A14 ; port CLK10_P
ETH_R1x_N: J1.B24 ; port Ethernet.ETH_BID4_N
ETH_R1x_P: J1.B23 ; port Ethernet.ETH_BID4_P
ETH_Rx_N: J1.B21 ; port Ethernet.ETH_RxD2_N
ETH_Rx_P: J1.B20 ; port Ethernet.ETH_RxD2_P
ETH_T1x_N: J1.A22 ; port Ethernet.ETH_BID3_N
ETH_T1x_P: J1.A21 ; port Ethernet.ETH_BID3_P
ETH_Tx_N: J1.A20 ; port Ethernet.ETH_TxD1_N
ETH_Tx_P: J1.A19 ; port Ethernet.ETH_TxD1_P
FAULTn: J1.B7 ; port FAULTn
GA0: J1.B1 ; port GA0
GA1: J1.B2 ; port GA1
GA2: J1.B3 ; port GA2
GA3: J1.B4 ; port GA3
HSPI_AD0: J1.B8 ; port HSPI_AD0
HSPI_AD1: J1.B9 ; port HSPI_AD1
HSPI_AD2: J1.B10 ; port HSPI_AD2
HSPI_AD3: J1.B11 ; port HSPI_AD3
HSPI_CLK: J1.A5 ; port HSPI_CLK
HSPI_CSn: J1.A8 ; port HSPI_CSn
HSPI_ID: J1.A6 ; port HSPI_ID
HSPI_Q: J1.A9 ; port HSPI_Q
HSPI_sAD0: J1.A12 ; port HSPI_sAD0
HSPI_sAD1: J1.A11 ; port HSPI_sAD1
Module_EN: J1.B14 ; port Module_EN
PPS: J1.B15 ; port PPS
RESETn_I: J1.B12 ; port RESETn_I  [project net RESETn]
SCL: J1.B5 ; port SCL
SDA: J1.B6 ; port SDA
TCK: J1.B28 ; port JTAG.TCK
TDI: J1.A27 ; port JTAG.TDI
TDO: J1.B27 ; port JTAG.TDO
TIME: J1.A18 ; port TIME
TMS: J1.A28 ; port JTAG.TMS
TRIG: J1.A17 ; port TRIG
UART_RxD: J1.A25
UART_TxD: J1.B26
NetJ1_B17: J1.B17 ; port Power_Budget_Bus

### Layout directives
differential pair: CLK10_N, CLK10_P, ETH_R1x_N, ETH_R1x_P, ETH_Rx_N, ETH_Rx_P, ETH_T1x_N, ETH_T1x_P, ETH_Tx_N, ETH_Tx_P

### Notes on the sheet
- AC COUPLE!!!
  12V from PSU
- Project/Equipment
- Document
- Designer
- Drawn by
- Check.by
- Copyright WUT ISE 2018.
  This documentation describes Open Hardware and is licensed under the CERN OHL v.1.1. You may redistribute and modify this documentation under the terms of the CERN OHL v.1.1. (http://ohwr.org/CERNOHL). This documentation is distributed WITHOUT ANY EXPRESS OR IMPLIED WARRANTY, INCLUDING OF MERCHANTABILITY, SATISFACTORY QUALITY AND FITNESS FOR A PARTICULAR PURPOSE. Please see the CERN OHL v.1.1 for applicable conditions.
- Contact
- File
- Last Mod.
- Print Date
- Sheet
- Size
- A3
- of
- Rev

### Library data of the parts
J1 = AMPHENOL_MINI-Cool-56P: 64 contacts Board Eddge PCI Express x4 Socket; Part Description: PCB Mini Cool Edge 0.60mm,Storage and Server connector ,Gen Z, 56 signal pins, SMT; PressFit: No; Part Number: AMPHENOL_MINI-Cool-56P; Component Kind: Standard (No BOM); Component Type: Standard (No BOM); Pin Count: 56; Mounted: Yes; Socket: No; SMD: Yes; Sense: No; Status: None; Manufacturer: AMPHENOL; Manufacturer Part Number: AMPHENOL_MINI-Cool-56P; ComponentHeight: 0mm; HelpURL: \\cern.ch\dfs\Applications\Altium\Datasheets\AMPHENOL_ME1005610101011.pdf; Author: CERN DEM HF; CreateDate: 05.01.2026; LatestRevisionDate: 05.01.2026

## Sheet CPLD.SchDoc: =Project
size 420 x 297 mm; Author: G.Kasprowicz; CompanyName: WUT ISE; DrawnBy: G.Kasprowicz; Organization: WUT ISE; Address1: PW ISE; Address2: Nowowiejska 15/19 00-665 Warsaw; Address3: gkasprow@gmail.com; SheetNumber: -; SheetTotal: -; ModifiedBy: -; CheckedDate: -; Title2: CPLD; DivGrp: WUT ISE; Designer: G.Kasprowicz; SPICEModelCacheRYPVXPCY: <root> / <DocumentId>RYPVXPCY</DocumentId> / </root>; ModifiedDate: -; ProjectName: Sensor Box
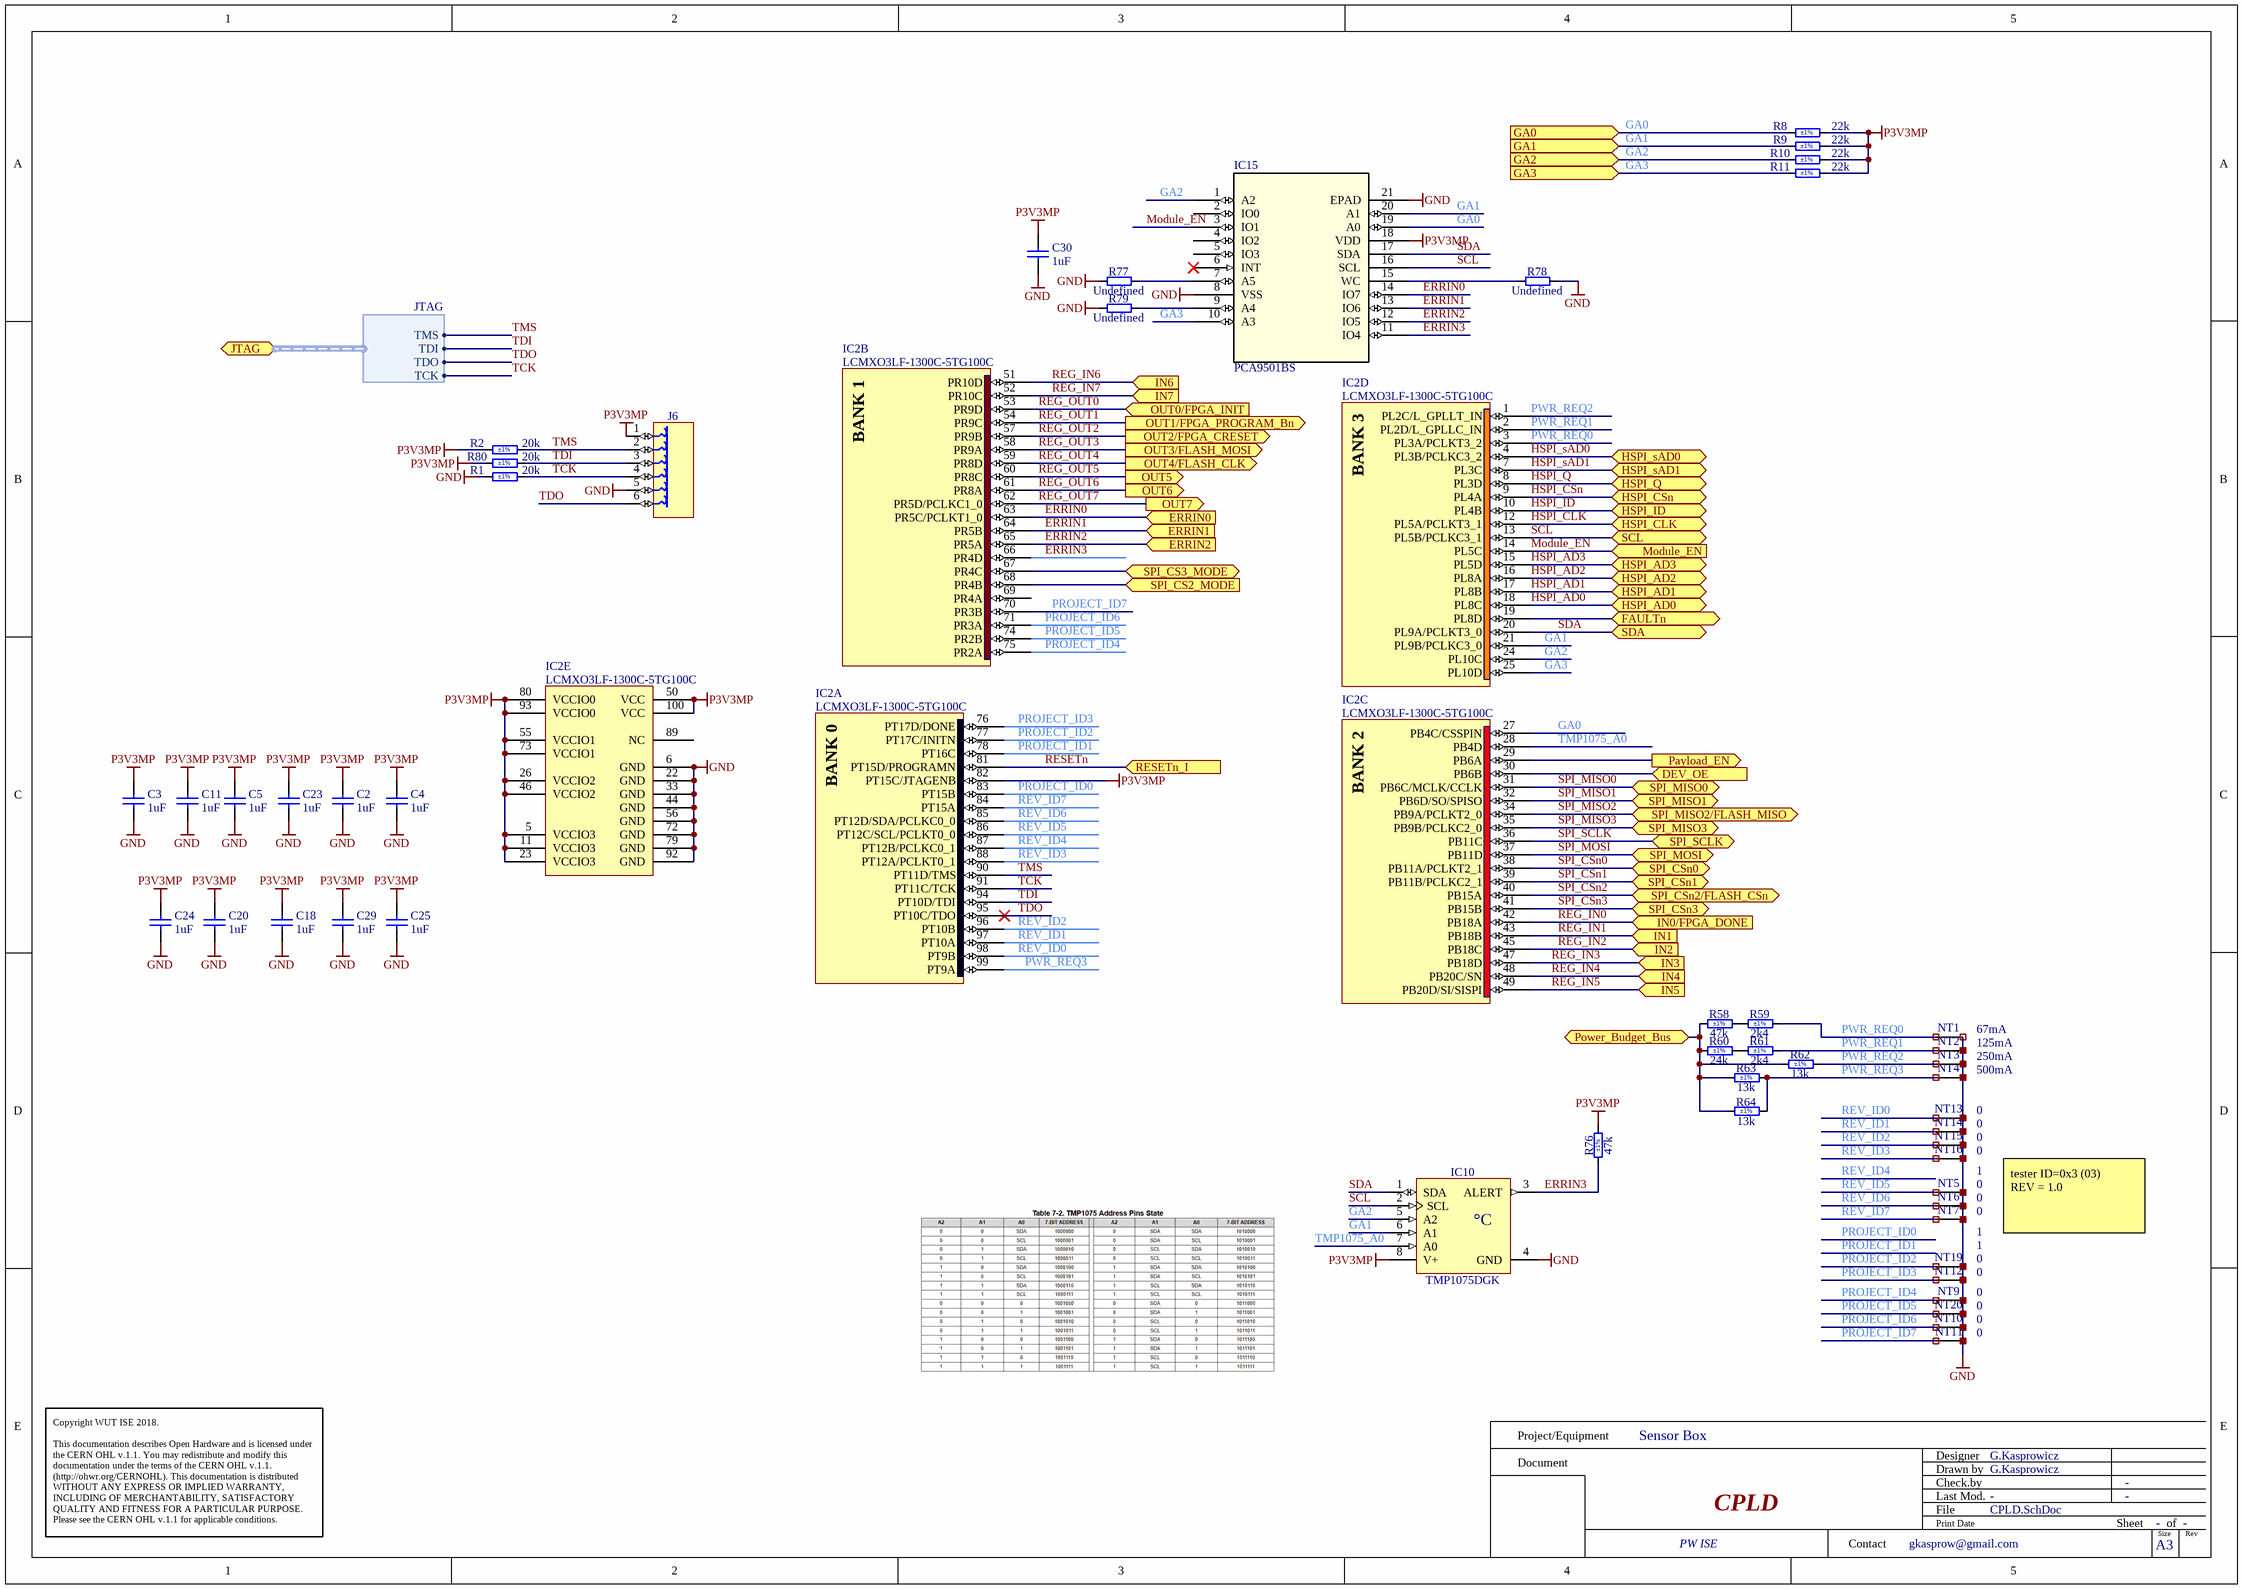
[diagram p2: CPLD.SchDoc]

### Parts
C2  1uF  [CAPC1005X55N]
C3  1uF  [CAPC1005X55N]
C4  1uF  [CAPC1005X55N]
C5  1uF  [CAPC1005X55N]
C11  1uF  [CAPC1005X55N]
C18  1uF  [CAPC1005X55N]
C20  1uF  [CAPC1005X55N]
C23  1uF  [CAPC1005X55N]
C24  1uF  [CAPC1005X55N]
C25  1uF  [CAPC1005X55N]
C29  1uF  [CAPC1005X55N]
C30  1uF  [CAPC1005X55N]
IC2  LCMXO3LF-1300C-5TG100C  [QFP50P1600X1600X160-100N]  (parts A,B,C,D,E of 5)
IC10  TMP1075DGK  [SOP65P490X110-8N]
IC15  PCA9501BS  [HVQFN20_SOT662-1_5X5_NXP]
J6  TC2030-MCP  [TC2030-MCP]  (value not drawn)  (no BOM)
NT1  Net Tie  [Net Tie 3]  (value not drawn)  (net tie, no BOM)
NT2  Net Tie  [Net Tie 3]  (value not drawn)  (net tie, no BOM)
NT3  Net Tie  [Net Tie 3]  (value not drawn)  (net tie, no BOM)
NT4  Net Tie  [Net Tie 3]  (value not drawn)  (net tie, no BOM)
NT5  Net Tie  [Net Tie 3]  (value not drawn)  (net tie, no BOM)
NT6  Net Tie  [Net Tie 3]  (value not drawn)  (net tie, no BOM)
NT7  Net Tie  [Net Tie 3]  (value not drawn)  (net tie, no BOM)
NT9  Net Tie  [Net Tie 3]  (value not drawn)  (net tie, no BOM)
NT10  Net Tie  [Net Tie 3]  (value not drawn)  (net tie, no BOM)
NT11  Net Tie  [Net Tie 3]  (value not drawn)  (net tie, no BOM)
NT12  Net Tie  [Net Tie 3]  (value not drawn)  (net tie, no BOM)
NT13  Net Tie  [Net Tie 3]  (value not drawn)  (net tie, no BOM)
NT14  Net Tie  [Net Tie 3]  (value not drawn)  (net tie, no BOM)
NT15  Net Tie  [Net Tie 3]  (value not drawn)  (net tie, no BOM)
NT16  Net Tie  [Net Tie 3]  (value not drawn)  (net tie, no BOM)
NT19  Net Tie  [Net Tie 3]  (value not drawn)  (net tie, no BOM)
NT20  Net Tie  [Net Tie 3]  (value not drawn)  (net tie, no BOM)
R1  20k  Tolerance: ±1%  [RESC1005X40N]
R2  20k  Tolerance: ±1%  [RESC1005X40N]
R8  22k  Tolerance: ±1%  [RESC1005X40N]
R9  22k  Tolerance: ±1%  [RESC1005X40N]
R10  22k  Tolerance: ±1%  [RESC1005X40N]
R11  22k  Tolerance: ±1%  [RESC1005X40N]
R58  47k  Tolerance: ±1%  [RESC1005X40N]
R59  2k4  Tolerance: ±1%  [RESC1005X40N]
R60  24k  Tolerance: ±1%  [RESC1005X40N]
R61  2k4  Tolerance: ±1%  [RESC1005X40N]
R62  13k  Tolerance: ±1%  [RESC1005X40N]
R63  13k  Tolerance: ±1%  [RESC1005X40N]
R64  13k  Tolerance: ±1%  [RESC1005X40N]
R76  47k  Tolerance: ±1%  [RESC1005X40N]
R77  Undefined  [RESC1005X40N]
R78  Undefined  [RESC1005X40N]
R79  Undefined  [RESC1005X40N]
R80  20k  Tolerance: ±1%  [RESC1005X40N]

### Ports
DEV_OE (in), ERRIN0 (in), ERRIN1 (in), ERRIN2 (in), FAULTn (bidir), GA0 (in), GA1 (in), GA2 (in), GA3 (in), HSPI_AD0 (bidir), HSPI_AD1 (bidir), HSPI_AD2 (bidir), HSPI_AD3 (bidir), HSPI_CLK (bidir), HSPI_CSn (bidir), HSPI_ID (bidir), HSPI_Q (bidir), HSPI_sAD0 (bidir), HSPI_sAD1 (bidir), IN0/FPGA_DONE (in), IN1 (in), IN2 (in), IN3 (in), IN4 (in), IN5 (in), IN6 (in), IN7 (in), JTAG (bidir, harness JTAG), Module_EN (in), OUT0/FPGA_INIT (in), OUT1/FPGA_PROGRAM_Bn (out), OUT2/FPGA_CRESET (out), OUT3/FLASH_MOSI (out), OUT4/FLASH_CLK (out), OUT5 (out), OUT6 (out), OUT7 (out), Payload_EN (out), Power_Budget_Bus (bidir), RESETn_I (in), SCL (bidir), SDA (bidir), SPI_CS2_MODE (in), SPI_CS3_MODE (bidir), SPI_CSn0 (bidir), SPI_CSn1 (bidir), SPI_CSn2/FLASH_CSn (bidir), SPI_CSn3 (bidir), SPI_MISO0 (bidir), SPI_MISO1 (bidir), SPI_MISO2/FLASH_MISO (bidir), SPI_MISO3 (bidir), SPI_MOSI (bidir), SPI_SCLK (bidir)

### Harnesses
JTAG: TMS, TDI, TDO, TCK

### Nets
GND: C2.1 C3.1 C4.1 C5.1 C11.1 C18.1 C20.1 C23.1 C24.1 C25.1 C29.1 C30.1 IC2.6(GND) IC2.22(GND) IC2.33(GND) IC2.44(GND) IC2.56(GND) IC2.72(GND) IC2.79(GND) IC2.92(GND) IC10.4(GND) IC15.8(VSS) IC15.21(EPAD) J6.5 NT1.2 NT2.2 NT3.2 NT4.2 NT5.2 NT6.2 NT7.2 NT9.2 NT10.2 NT11.2 NT12.2 NT13.2 NT14.2 NT15.2 NT16.2 NT19.2 NT20.2 R1.2 R77.1 R78.2 R79.1
P3V3MP: C2.2 C3.2 C4.2 C5.2 C11.2 C18.2 C20.2 C23.2 C24.2 C25.2 C29.2 C30.2 IC2.5(VCCIO3) IC2.11(VCCIO3) IC2.23(VCCIO3) IC2.26(VCCIO2) IC2.46(VCCIO2) IC2.50(VCC) IC2.55(VCCIO1) IC2.73(VCCIO1) IC2.80(VCCIO0) IC2.82(PT15C/JTAGENB) IC2.93(VCCIO0) IC2.100(VCC) IC10.8(V+) IC15.18(VDD) J6.1 R2.2 R8.1 R9.1 R10.1 R11.1 R76.2 R80.2
ERRIN0: IC2.63(PR5C/PCLKT1_0) IC15.14(IO7) ; port ERRIN0
ERRIN1: IC2.64(PR5B) IC15.13(IO6) ; port ERRIN1
ERRIN2: IC2.65(PR5A) IC15.12(IO5) ; port ERRIN2
ERRIN3: IC2.66(PR4D) IC10.3(ALERT) IC15.11(IO4) R76.1
FAULTn: IC2.19(PL8D) ; port FAULTn
GA0: IC2.27(PB4C/CSSPIN) IC15.19(A0) R8.2 ; port GA0
GA1: IC2.21(PL9B/PCLKC3_0) IC10.6(A1) IC15.20(A1) R9.2 ; port GA1
GA2: IC2.24(PL10C) IC10.5(A2) IC15.1(A2) R10.2 ; port GA2
GA3: IC2.25(PL10D) IC15.10(A3) R11.2 ; port GA3
HSPI_AD0: IC2.18(PL8C) ; port HSPI_AD0
HSPI_AD1: IC2.17(PL8B) ; port HSPI_AD1
HSPI_AD2: IC2.16(PL8A) ; port HSPI_AD2
HSPI_AD3: IC2.15(PL5D) ; port HSPI_AD3
HSPI_CLK: IC2.12(PL5A/PCLKT3_1) ; port HSPI_CLK
HSPI_CSn: IC2.9(PL4A) ; port HSPI_CSn
HSPI_ID: IC2.10(PL4B) ; port HSPI_ID
HSPI_Q: IC2.8(PL3D) ; port HSPI_Q
HSPI_sAD0: IC2.4(PL3B/PCLKC3_2) ; port HSPI_sAD0
HSPI_sAD1: IC2.7(PL3C) ; port HSPI_sAD1
Module_EN: IC2.14(PL5C) IC15.3(IO1) ; port Module_EN
Payload_EN: IC2.29(PB6A) ; port Payload_EN
PROJECT_ID0: IC2.83(PT15B)
PROJECT_ID1: IC2.78(PT16C)
PROJECT_ID2: IC2.77(PT17C/INITN) NT19.1
PROJECT_ID3: IC2.76(PT17D/DONE) NT12.1
PROJECT_ID4: IC2.75(PR2A) NT9.1
PROJECT_ID5: IC2.74(PR2B) NT20.1
PROJECT_ID6: IC2.71(PR3A) NT10.1
PROJECT_ID7: IC2.70(PR3B) NT11.1
PWR_REQ0: IC2.3(PL3A/PCLKT3_2) NT1.1 R59.2
PWR_REQ1: IC2.2(PL2D/L_GPLLC_IN) NT2.1 R61.2
PWR_REQ2: IC2.1(PL2C/L_GPLLT_IN) NT3.1 R62.2
PWR_REQ3: IC2.99(PT9A) NT4.1 R63.2 R64.2
REG_IN0: IC2.42(PB18A) ; port IN0/FPGA_DONE
REG_IN1: IC2.43(PB18B) ; port IN1
REG_IN2: IC2.45(PB18C) ; port IN2
REG_IN3: IC2.47(PB18D) ; port IN3
REG_IN4: IC2.48(PB20C/SN) ; port IN4
REG_IN5: IC2.49(PB20D/SI/SISPI) ; port IN5
REG_IN6: IC2.51(PR10D) ; port IN6
REG_IN7: IC2.52(PR10C) ; port IN7
REG_OUT0: IC2.53(PR9D) ; port OUT0/FPGA_INIT
REG_OUT1: IC2.54(PR9C) ; port OUT1/FPGA_PROGRAM_Bn
REG_OUT2: IC2.57(PR9B) ; port OUT2/FPGA_CRESET
REG_OUT3: IC2.58(PR9A) ; port OUT3/FLASH_MOSI
REG_OUT4: IC2.59(PR8D) ; port OUT4/FLASH_CLK
REG_OUT5: IC2.60(PR8C) ; port OUT5
REG_OUT6: IC2.61(PR8A) ; port OUT6
REG_OUT7: IC2.62(PR5D/PCLKC1_0) ; port OUT7
RESETn: IC2.81(PT15D/PROGRAMN) ; port RESETn_I
REV_ID0: IC2.98(PT9B) NT13.1
REV_ID1: IC2.97(PT10A) NT14.1
REV_ID2: IC2.96(PT10B) NT15.1
REV_ID3: IC2.88(PT12A/PCLKT0_1) NT16.1
REV_ID4: IC2.87(PT12B/PCLKC0_1)
REV_ID5: IC2.86(PT12C/SCL/PCLKT0_0) NT5.1
REV_ID6: IC2.85(PT12D/SDA/PCLKC0_0) NT6.1
REV_ID7: IC2.84(PT15A) NT7.1
SCL: IC2.13(PL5B/PCLKC3_1) IC10.2(SCL) IC15.16(SCL) ; port SCL
SDA: IC2.20(PL9A/PCLKT3_0) IC10.1(SDA) IC15.17(SDA) ; port SDA
SPI_CSn0: IC2.38(PB11A/PCLKT2_1) ; port SPI_CSn0
SPI_CSn1: IC2.39(PB11B/PCLKC2_1) ; port SPI_CSn1
SPI_CSn2: IC2.40(PB15A) ; port SPI_CSn2/FLASH_CSn
SPI_CSn3: IC2.41(PB15B) ; port SPI_CSn3
SPI_MISO0: IC2.31(PB6C/MCLK/CCLK) ; port SPI_MISO0
SPI_MISO1: IC2.32(PB6D/SO/SPISO) ; port SPI_MISO1
SPI_MISO2: IC2.34(PB9A/PCLKT2_0) ; port SPI_MISO2/FLASH_MISO
SPI_MISO3: IC2.35(PB9B/PCLKC2_0) ; port SPI_MISO3
SPI_MOSI: IC2.37(PB11D) ; port SPI_MOSI
SPI_SCLK: IC2.36(PB11C) ; port SPI_SCLK  [project net SPI_CLK]
TCK: IC2.91(PT11C/TCK) J6.4 R1.1 ; port JTAG.TCK
TDI: IC2.94(PT10D/TDI) J6.3 R80.1 ; port JTAG.TDI
TDO: IC2.95(PT10C/TDO) J6.6 ; port JTAG.TDO
TMP1075_A0: IC2.28(PB4D) IC10.7(A0)
TMS: IC2.90(PT11D/TMS) J6.2 R2.1 ; port JTAG.TMS
NetIC2_30: IC2.30(PB6B) ; port DEV_OE
NetIC2_67: IC2.67(PR4C) ; port SPI_CS3_MODE
NetIC2_68: IC2.68(PR4B) ; port SPI_CS2_MODE
NetIC15_7: IC15.7(A5) R77.2
NetIC15_9: IC15.9(A4) R79.2
NetIC15_15: IC15.15(WC) R78.1
NetJ1_B17: R58.1 R60.1 R62.1 R63.1 R64.1 ; port Power_Budget_Bus
NetR58_2: R58.2 R59.1
NetR60_2: R60.2 R61.1

Not connected (* = marked no-connect by the designer): IC2 69(PR4A) 89(NC); IC15 2(IO0) 4(IO2) 5(IO3) 6(INT)*

### Notes on the sheet
- 500mA
- 250mA
- 125mA
- 67mA
- 0
- 1
- tester ID=0x3 (03)
  REV = 1.0
- Project/Equipment
- Document
- Designer
- Drawn by
- Check.by
- Copyright WUT ISE 2018.
  This documentation describes Open Hardware and is licensed under the CERN OHL v.1.1. You may redistribute and modify this documentation under the terms of the CERN OHL v.1.1. (http://ohwr.org/CERNOHL). This documentation is distributed WITHOUT ANY EXPRESS OR IMPLIED WARRANTY, INCLUDING OF MERCHANTABILITY, SATISFACTORY QUALITY AND FITNESS FOR A PARTICULAR PURPOSE. Please see the CERN OHL v.1.1 for applicable conditions.
- Contact
- File
- Last Mod.
- Print Date
- Sheet
- Size
- A3
- of
- Rev
- (in symbol LCMXO3LF-1300C-5TG100C, part A) BANK 0
- (in symbol LCMXO3LF-1300C-5TG100C, part B) BANK 1
- (in symbol LCMXO3LF-1300C-5TG100C, part C) BANK 2
- (in symbol LCMXO3LF-1300C-5TG100C, part D) BANK 3
- (in symbol TMP1075DGK) °C

### Library data of the parts
C2-C5 C11 C18 C20 C23-C25 C29 C30 = CC0402_1UF_16V_10%_X5R: Non-polarised capacitor; Part Description: SMD Multilayer Chip Ceramic Capacitor; Manufacturer: GENERIC; Manufacturer1 Part Number: C1005X5R1C105KT; Voltage: 16V; TC: X5R; Tolerance: ±10%; Part Number: CC0402_1UF_16V_10%_X5R; Component Kind: Standard; Component Type: Standard; Pin Count: 2; Value: 1uF; Status: Preferred; Manufacturer Part Number: CC0402_1UF_16V_10%_X5R; Case: 0402; Mounted: Yes; Socket: No; SMD: Yes; Sense: No; Manufacturer1 Example: TDK; Manufacturer1 ComponentHeight: 0.55mm; HelpURL: \\cern.ch\dfs\Applications\Altium\Datasheets\CC0402_X5R_TDK_C.pdf; Author: CERN DEM JLC; CreateDate: 25.10.2012; LatestRevisionDate: 25.10.2012
IC2 = LCMXO3LF-1300C-5TG100C: MachXO2, 2.5V/3.3V High-Performance 2000 Macrocell CPLD, 80 I/Os, 100-Pin TQFP, Speed Grade 4, Industrial Grade; Part Description: MachXO3LF, 2.5V/3.3V Low-Density Ultra-Low Power FPGA, 1300 LUTs, 80 I/Os, 100-Pin TQFP, Speed Grade 5, Commercial Grade; Manufacturer: LATTICE SEMICONDUCTOR; PressFit: No; Bonding: No; Part Number: LCMXO3LF-1300C-5TG100C; Component Kind: Standard; Component Type: Standard; Device: LCMXO3LF-1300C-5TG100C; PackageDescription: QFP, 0.50mm Pitch, Square; 100 Pin, 14.0mm L X 14.0mm W X 1.60mm H body, IPC Medium Density; Manufacturer Part Number: LCMXO3LF-1300C-5TG100C; Pin Count: 100; Case: QFP100; Mounted: Yes; Socket: No; SMD: Yes; Sense: No; ComponentHeight: 1.6mm; HelpURL: \\cern.ch\dfs\Applications\Altium\Datasheets\LCMXO3LF_Serie.pdf; ComponentLink1URL: \\cern.ch\dfs\Applications\Altium\Datasheets\LATTICE_Package.pdf; ComponentLink1Description: Package Drawing; ComponentLink2URL: \\cern.ch\dfs\Applications\Altium\Datasheets\LCMXO3LF-1300C-5TG100_Pinout.pdf; ComponentLink2Description: Pinout; Author: CERN DEM MR; CreateDate: 18.06.2019; LatestRevisionDate: 18.06.2019
IC10 = TMP1075DGK: High Accuracy Temperature Sensor With I2C and SMBus Interface in Industry Standard LM75; Manufacturer: TEXAS INSTRUMENTS; PressFit: No; Bonding: No; Part Number: TMP1075DGK; Component Kind: Standard; Component Type: Standard; Device: TMP1075DGK; PackageDescription: SOP, 0.65mm Pitch; 8 Pin, 3.00mm W X 3.00mm L X 1.10mm H body, IPC Medium Density; Part Description: High Accuracy Temperature Sensor with I2C and SMBus Interface in Industry Standard LM75; Manufacturer Part Number: TMP1075DGK; Pin Count: 8; Case: uSOP8; Mounted: Yes; Socket: No; SMD: Yes; Sense: No; ComponentHeight: 1.1mm; HelpURL: \\cern.ch\dfs\Applications\Altium\Datasheets\TMP1075DGK.pdf; Author: CERN DEM MR; CreateDate: 04.10.2019; LatestRevisionDate: 04.10.2019
IC15 = IFC_PCA9501BS: 8-bit I2C-bus and SMBus I/O port with interrupt, 2-kbit / EEPROM and 6 address pins; Manufacturer: NXP; Manufacturer Part Number: PCA9501BS,118; Part Number: PCA9501BS
J6 = TC2030-MCP: TC2030-MCP and TC2030-MCP-NL Pad Contact; Part Description: 6 X 31mil Diameter SMD Pad For TC2030-MCP Legged Connector; Mounted: No; Part Number: TC2030-MCP; Component Type: Standard (No BOM); Pin Count: 6; Family: TC2030-MCP; Socket: No; SMD: Yes; Sense: No; Status: None; ComponentHeight: 0mm; HelpURL: \\cern.ch\dfs\Applications\Altium\Datasheets\TC2030-MCP.pdf; Author: CERN DEM HF; CreateDate: 27.03.2023; LatestRevisionDate: 27.03.2023; PackageDescription: 6 X 31mil Diameter SMD Pad For TC2030-MCP Legged Connector
NT1-NT7 NT9-NT16 NT19 NT20 = Net Tie 3: Part Description: Net Tie (2 Nets); Mounted: No; Part Number: Net Tie 3; Component Type: Net Tie; Pin Count: 2; Family: Net Tie; Socket: No; SMD: No; Sense: No; Status: None; ComponentHeight: 0mm; HelpURL: Undefined; Author: CERN DEM HF; CreateDate: 23.09.2024; LatestRevisionDate: 23.09.2024; PackageDescription: SMD Net Tie
R1 R2 R80 = R0402_20K_1%_0.0625W_100PPM: Resistor - 1%; Part Description: General Purpose Thick Film Chip Resistor; Manufacturer: GENERIC; Manufacturer1 Part Number: 232270672003L; TC: ±100ppm/°C; PressFit: No; Part Number: R0402_20K_1%_0.0625W_100PPM; Component Kind: Standard; Component Type: Standard; Pin Count: 2; Value: 20k; Status: Not Recommended; Power: 0.0625W; Manufacturer Part Number: R0402_20K_1%_0.0625W_100PPM; Case: 0402; Mounted: Yes; Sense: No; Socket: No; SMD: Yes; Manufacturer1 Example: YAGEO PHYCOMP; Manufacturer1 ComponentHeight: 0.4mm; HelpURL: \\cern.ch\dfs\Applications\Altium\Datasheets\R0402_Phycomp_RC0402.pdf; Author: CERN DEM JLC; CreateDate: 03.12.2007; LatestRevisionDate: 17.10.2012
R8-R11 = R0402_22K_1%_0.0625W_100PPM: Resistor - 1%; Part Description: General Purpose Thick Film Chip Resistor; Manufacturer: GENERIC; Manufacturer1 Part Number: 232270672203L; TC: ±100ppm/°C; PressFit: No; Part Number: R0402_22K_1%_0.0625W_100PPM; Component Kind: Standard; Component Type: Standard; Pin Count: 2; Value: 22k; Status: Not Recommended; Power: 0.0625W; Manufacturer Part Number: R0402_22K_1%_0.0625W_100PPM; Case: 0402; Mounted: Yes; Sense: No; Socket: No; SMD: Yes; Manufacturer1 Example: YAGEO PHYCOMP; Manufacturer1 ComponentHeight: 0.4mm; HelpURL: \\cern.ch\dfs\Applications\Altium\Datasheets\R0402_Phycomp_RC0402.pdf; Author: CERN DEM JLC; CreateDate: 03.12.2007; LatestRevisionDate: 17.10.2012
R58 R76 = R0402_47K_1%_0.0625W_100PPM: Resistor - 1%; Part Description: General Purpose Thick Film Chip Resistor; Manufacturer: GENERIC; Manufacturer1 Part Number: 232270674703L; TC: ±100ppm/°C; PressFit: No; Part Number: R0402_47K_1%_0.0625W_100PPM; Component Kind: Standard; Component Type: Standard; Pin Count: 2; Value: 47k; Status: Not Recommended; Power: 0.0625W; Manufacturer Part Number: R0402_47K_1%_0.0625W_100PPM; Case: 0402; Mounted: Yes; Sense: No; Socket: No; SMD: Yes; Manufacturer1 Example: YAGEO PHYCOMP; Manufacturer1 ComponentHeight: 0.4mm; HelpURL: \\cern.ch\dfs\Applications\Altium\Datasheets\R0402_Phycomp_RC0402.pdf; Author: CERN DEM JLC; CreateDate: 03.12.2007; LatestRevisionDate: 17.10.2012
R59 R61 = R0402_2K4_1%_0.0625W_100PPM: Resistor - 1%; Part Description: General Purpose Thick Film Chip Resistor; Manufacturer: GENERIC; Manufacturer1 Part Number: 232270672402L; TC: ±100ppm/°C; PressFit: No; Part Number: R0402_2K4_1%_0.0625W_100PPM; Component Kind: Standard; Component Type: Standard; Pin Count: 2; Value: 2k4; Status: Not Recommended; Power: 0.0625W; Manufacturer Part Number: R0402_2K4_1%_0.0625W_100PPM; Case: 0402; Mounted: Yes; Sense: No; Socket: No; SMD: Yes; Manufacturer1 Example: YAGEO PHYCOMP; Manufacturer1 ComponentHeight: 0.4mm; HelpURL: \\cern.ch\dfs\Applications\Altium\Datasheets\R0402_Phycomp_RC0402.pdf; Author: CERN DEM JLC; CreateDate: 03.12.2007; LatestRevisionDate: 17.10.2012
R60 = R0402_24K_1%_0.0625W_100PPM: Resistor - 1%; Part Description: General Purpose Thick Film Chip Resistor; Manufacturer: GENERIC; Manufacturer1 Part Number: 232270672403L; TC: ±100ppm/°C; PressFit: No; Part Number: R0402_24K_1%_0.0625W_100PPM; Component Kind: Standard; Component Type: Standard; Pin Count: 2; Value: 24k; Status: Not Recommended; Power: 0.0625W; Manufacturer Part Number: R0402_24K_1%_0.0625W_100PPM; Case: 0402; Mounted: Yes; Sense: No; Socket: No; SMD: Yes; Manufacturer1 Example: YAGEO PHYCOMP; Manufacturer1 ComponentHeight: 0.4mm; HelpURL: \\cern.ch\dfs\Applications\Altium\Datasheets\R0402_Phycomp_RC0402.pdf; Author: CERN DEM JLC; CreateDate: 03.12.2007; LatestRevisionDate: 17.10.2012
R62-R64 = R0402_13K_1%_0.0625W_100PPM: as R21 on sheet MOD-ADC-10; Part Number: R0402_13K_1%_0.0625W_100PPM; Component Kind: Standard; Component Type: Standard; Pin Count: 2; Value: 13k; Status: Not Recommended; Power: 0.0625W; Manufacturer Part Number: R0402_13K_1%_0.0625W_100PPM; Case: 0402; Mounted: Yes; Sense: No; Socket: No; SMD: Yes; Manufacturer1 Example: YAGEO PHYCOMP; Manufacturer1 ComponentHeight: 0.4mm; HelpURL: \\cern.ch\dfs\Applications\Altium\Datasheets\R0402_Phycomp_RC0402.pdf; Author: CERN DEM JLC; CreateDate: 03.12.2007; LatestRevisionDate: 17.10.2012
R77-R79 = R0402_NO-VALUE: Resistor; Part Description: Reserved Footprint For a 0402 (1005) Chip Resistor; PressFit: No; Mounted: No; Part Number: R0402_NO-VALUE; Component Kind: Standard; Component Type: Standard; Pin Count: 2; Value: Undefined; Status: None; Manufacturer: Undefined; Manufacturer Part Number: R0402_NO-VALUE; Case: 0402; Sense: No; Socket: No; SMD: Yes; Manufacturer1 Example: Undefined; Manufacturer1 Part Number: Undefined; Manufacturer1 ComponentHeight: Undefined; HelpURL: Undefined; Author: CERN DEM JLC; CreateDate: 03.12.2007; LatestRevisionDate: 13.03.2008